# Altium schematic sheet USB-RS485.SchDoc
size A4
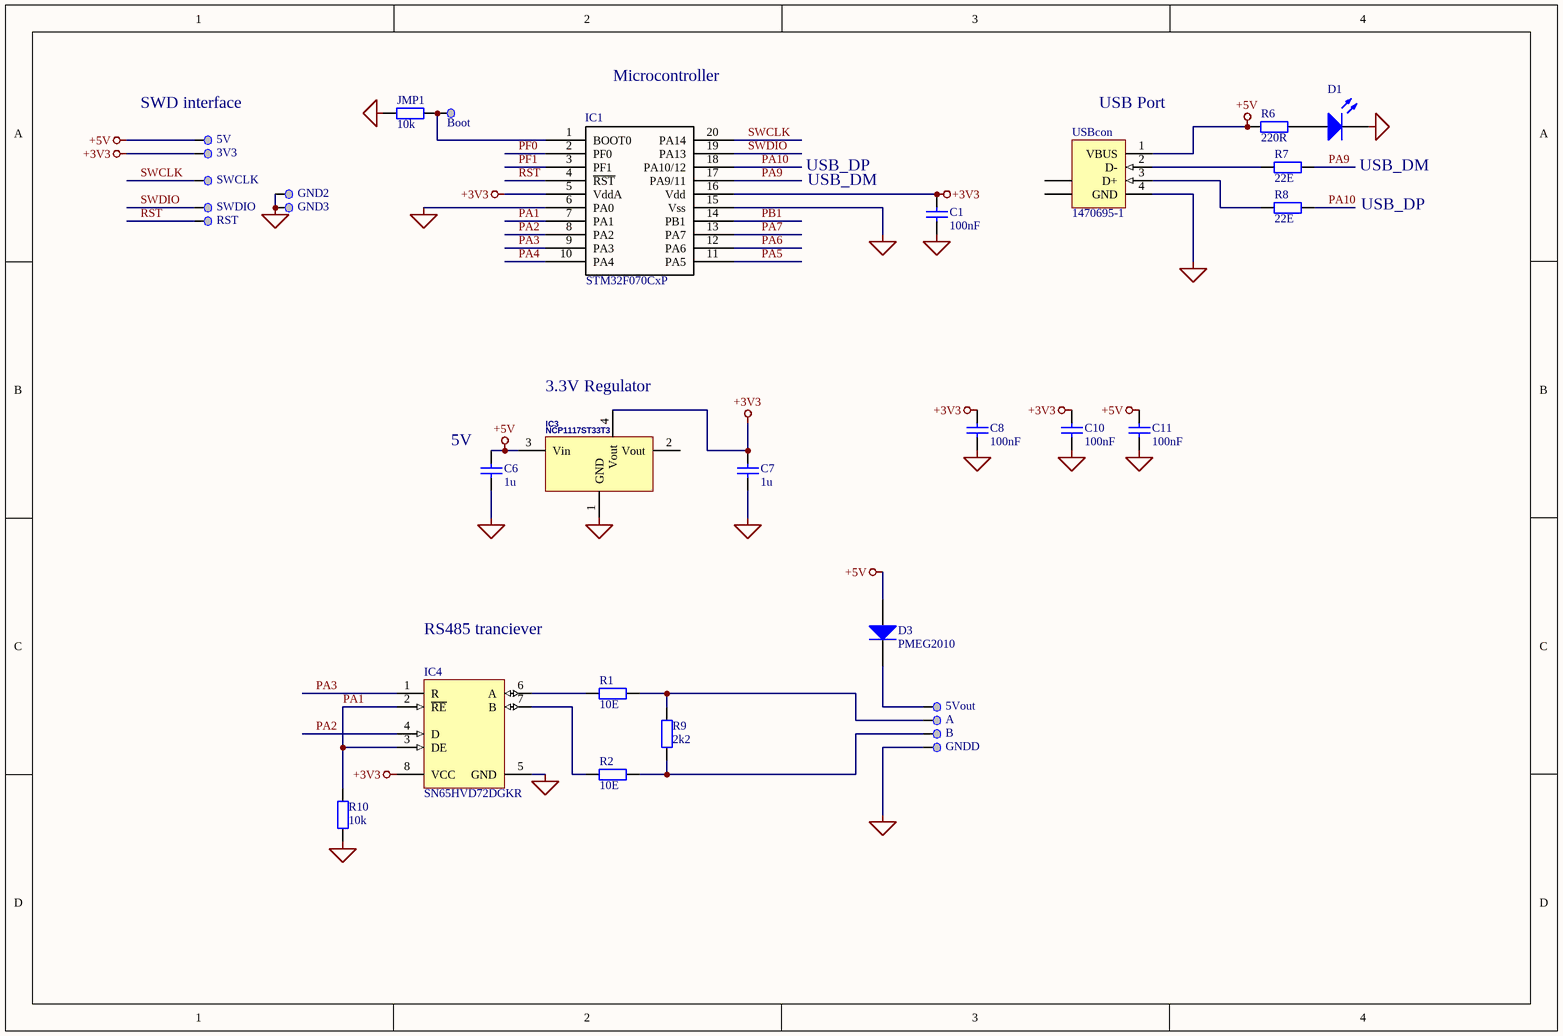
[diagram p0: USB-RS485.SchDoc]

## Parts
3V3  (no value)  [En_pin_TP]
5V  (no value)  [En_pin_TP]
5Vout  (no value)  [En_pin_TP]
A  (no value)  [En_pin_TP]
B  (no value)  [En_pin_TP]
Boot  (no value)  [En_pin_TP]
C1  value 100nF  [0603]
C6  1u  [0603]
C7  1u  [0603]
C8  value 100nF  [0603]
C10  value 100nF  [0603]
C11  value 100nF  [0603]
D1  LED3  [0603]  (value not drawn)
D3  PMEG2010  [SOD323]
GND2  (no value)  [En_pin_TP]
GND3  (no value)  [En_pin_TP]
GNDD  (no value)  [En_pin_TP]
IC1  STM32F070CxP  [TSOP65P640X110_HS-20N]
IC3  NCP1117ST33T3  [SOT223_M]
IC4  SN65HVD72DGKR  [DGK8_L]
JMP1  value 10k  [0603]  (hidden comment: Res2)
R1  value 10E  [0603]  (hidden comment: Res2)
R2  value 10E  [0603]  (hidden comment: Res2)
R6  value 220R  [0603]  (hidden comment: Res2)
R7  value 22E  [0603]  (hidden comment: Res2)
R8  value 22E  [0603]  (hidden comment: Res2)
R9  value 2k2  [0603]  (hidden comment: Res2)
R10  value 10k  [0603]  (hidden comment: Res2)
RST  (no value)  [En_pin_TP]
SWCLK  (no value)  [En_pin_TP]
SWDIO  (no value)  [En_pin_TP]
USBcon  1470695-1  [1470695]

## Nets
+3V3: 3V3.1 C1.1 C7.1 C8.1 C10.1 IC1.5(VddA) IC1.16(Vdd) IC3.4(Vout) IC4.8(VCC)
+5V: 5V.1 C6.1 C11.1 D3.1(A) IC3.3(Vin) R6.2 USBcon.1(VBUS)
SGND: C1.2 C6.2 C7.2 C8.2 C10.2 C11.2 D1.2(K) GND2.1 GND3.1 GNDD.1 IC1.6(PA0) IC1.15(Vss) IC3.1(GND) IC4.5(GND) JMP1.1 R10.2 USBcon.4(GND)
PA1: IC1.7(PA1) IC4.2(~{RE}) IC4.3(DE) R10.1
PA2: IC1.8(PA2) IC4.4(D)
PA3: IC1.9(PA3) IC4.1(R)
PA4: IC1.10(PA4)
PA5: IC1.11(PA5)
PA6: IC1.12(PA6)
PA7: IC1.13(PA7)
PA9: IC1.17(PA9/11) R7.1
PA10: IC1.18(PA10/12) R8.1
PB1: IC1.14(PB1)
PF0: IC1.2(PF0)
PF1: IC1.3(PF1)
RST: IC1.4(~{RST}) RST.1
SWCLK: IC1.20(PA14) SWCLK.1
SWDIO: IC1.19(PA13) SWDIO.1
Net5Vout_1: 5Vout.1 D3.2(K)
NetA_1: A.1 R1.1 R9.1
NetB_1: B.1 R2.1 R9.2
NetBoot_1: Boot.1 IC1.1(BOOT0) JMP1.2
NetD1_1: D1.1(A) R6.1
NetIC4_6: IC4.6(A) R1.2
NetIC4_7: IC4.7(B) R2.2
NetR7_2: R7.2 USBcon.2(D-)
NetR8_2: R8.2 USBcon.3(D+)

Not connected (* = marked no-connect by the designer): IC3 2(Vout); USBcon 5(SHLD) 6(SHLD)

## Notes on the sheet
- SWD interface
- Microcontroller
- (near USBcon) USB Port
- USB_DP
- (near D1) USB_DM
- USB_DM
- (near C6) 5V
- (near IC3) 3.3V Regulator
- RS485 tranciever

## Library data of the parts
3V3 5V 5Vout A B Boot GND2 GND3 GNDD RST SWCLK SWDIO = En_pin
C1 C6-C8 C10 C11 = Cap: Capacitor; Published: 8-Jun-2000; LatestRevisionDate: 17-Jul-2002; LatestRevisionNote: Re-released for DXP Platform.; PackageReference: RAD-0.3; Publisher: Altium Limited
  C6 C7: Supplier 1: Farnell; Supplier Part Number 1: 1833862
D1 = LED3: Typical BLUE SiC LED; Published: 8-Jun-2000; LatestRevisionDate: 17-Dec-2003; LatestRevisionNote: PCB Footprint replaced.; DatasheetVersion: 16-Apr-2002; PackageVersion: 16-Apr-2002; PackageReference: 3.5X2.8X1.9; Publisher: Altium Limited; PackageDescription: SM LED; 2 C-Bend Leads; Body 3.5 x 2.8 x 1.9 mm, inc leads (LxWxH typ)
D3 = Diode 1N4007: 1 Amp General Purpose Rectifier; Published: 8-Jun-2000; LatestRevisionDate: 17-Jul-2002; LatestRevisionNote: Re-released for DXP Platform.; DatasheetVersion: 1998; PackageVersion: Aug-1999; PackageReference: DO-41; Publisher: Altium Limited; Code_JEDEC: DO-204-AL; ComponentLink1Description: Manufacturer Link; ComponentLink1URL: http://www.fairchildsemi.com/; ComponentLink2Description: Datasheet; ComponentLink2URL: http://www.fairchildsemi.com/ds/1N%2F1N4001.pdf
IC3 = VOLTREG_LD1117S33: DETAILS: LOW DROP VOLTAGE REGULATOR 3V3; PRODUCER: ONSEMI: NCP1117ST33T3; SUPPLIER 4: SILICA
IC4 = SN65HVD20PE4: Extended Common-mode RS-485 Transceiver, 25 Mbps, 5 V, Half Duplex, -40 to 85 degC, 8-pin PDIP (P), Pb-Free (RoHS); Manufacturer: Texas Instruments; Eco-Plan: Green (RoHS & no Sb/Br); # of TX/RX: 1 TX / 1 RX; Drivers Per Package: 1; Isolated: No; Number of Nodes: 64; Signaling Rate(Mbps): 25; Common Mode Range: -20 to 25; ESD(kV): 16; Fault Protection(V): -27 to 27; Fail Safe: Idle, Open, Short; ICC(Max)(mA): 9; Supply Voltage(s)(V): 5; Rating: Catalog; DatasheetVersion: SLLS552E; PackageVersion: revE, Apr-2010; PackageReference: P8; PackageDescription: 8-Pin Plastic Dual-In-Line Package, Row Spacing 7.62 mm, Pitch 2.54 mm; Supplier 1: Digi-Key; Supplier Part Number 1: SN65HVD20PE4-ND; Supplier 2: Mouser; Supplier Part Number 2: 595-SN65HVD20PE4; SubFamily: RS-485; Receivers Per Package: 1; Duplex: Half; Footprint: SN75176; Mounting Technology: Through-hole; PartNumber: SN65HVD20PE4; Code_JEDEC: MS-001-BA; ComponentLink1Description: Datasheet; ComponentLink1URL: http://www.ti.com/general/docs/lit/getliterature.tsp?genericPartNumber=SN65HVD20&fileType=pdf; ComponentLink2Description: Package Specification; ComponentLink2URL: http://www.ti.com/litv/pdf/mpdi001b
JMP1 R1 R2 R6-R10 = Res2: Resistor; Published: 8-Jun-2000; LatestRevisionDate: 17-Jul-2002; LatestRevisionNote: Re-released for DXP Platform.; PackageReference: AXIAL-0.4; Publisher: Altium Limited
USBcon = 1470695-1: USB 1.1, Right Angle, SMT, A Type, Plug, 4 Position, Natural; ContactMaterial: Brass; ContactPlating: Gold (30) over Nickel (50); PCB_Layout: Complies with manufacturer's recommendation.; DrillSize: Corresponds to nominal value.; PanelGround: Without; Published: 15-Jul-2004; DatasheetDocument: 21-Jan-2003; PackageDocument: 21-Jan-2003; PackageReference: 1470695; Publisher: Altium Limited; HousingMaterial: Thermoplastic; ComponentLink1Description: Manufacturer Link; ComponentLink1URL: http://www.tycoelectronics.com/; ComponentLink2Description: Packaging Specification; ComponentLink2URL: http://ecommas.tycoelectronics.com/commerce/DocumentDelivery/DDEController?Action=showdoc&DocId=Customer+Drawing%7F1470695%7FO%7Fpdf%7FEnglish%7FC_1470695_O.pdf